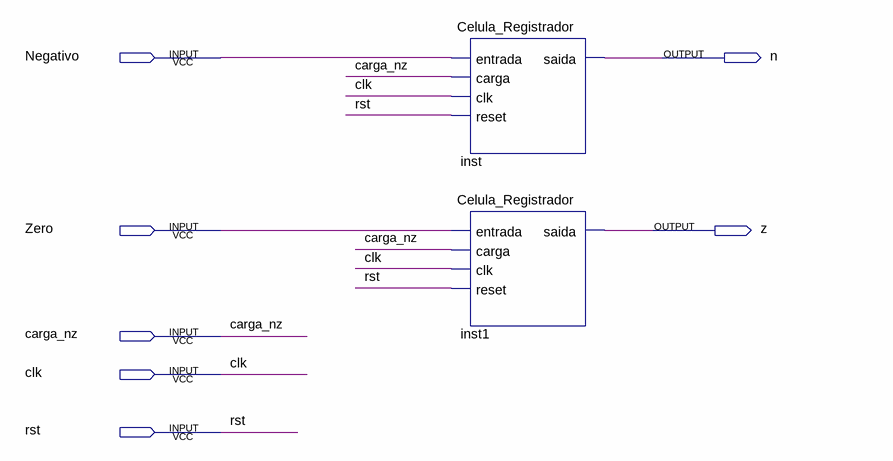
[diagram p0: schematic sheet]
// Quartus schematic Registrador_NZ_2b.bdf as structural Verilog: 2 symbols, 7 pins
module Registrador_NZ_2b (
  input  Negativo,
  input  Zero,
  input  carga_nz,
  input  clk,
  input  rst,
  output n,
  output z
);

  Celula_Registrador inst (.entrada(Negativo), .carga(carga_nz), .clk(clk), .reset(rst), .saida(n));
  Celula_Registrador inst1 (.entrada(Zero), .carga(carga_nz), .clk(clk), .reset(rst), .saida(z));
endmodule
